# EAGLE schematic SaLAltimeter (EAGLE 7.5.0)
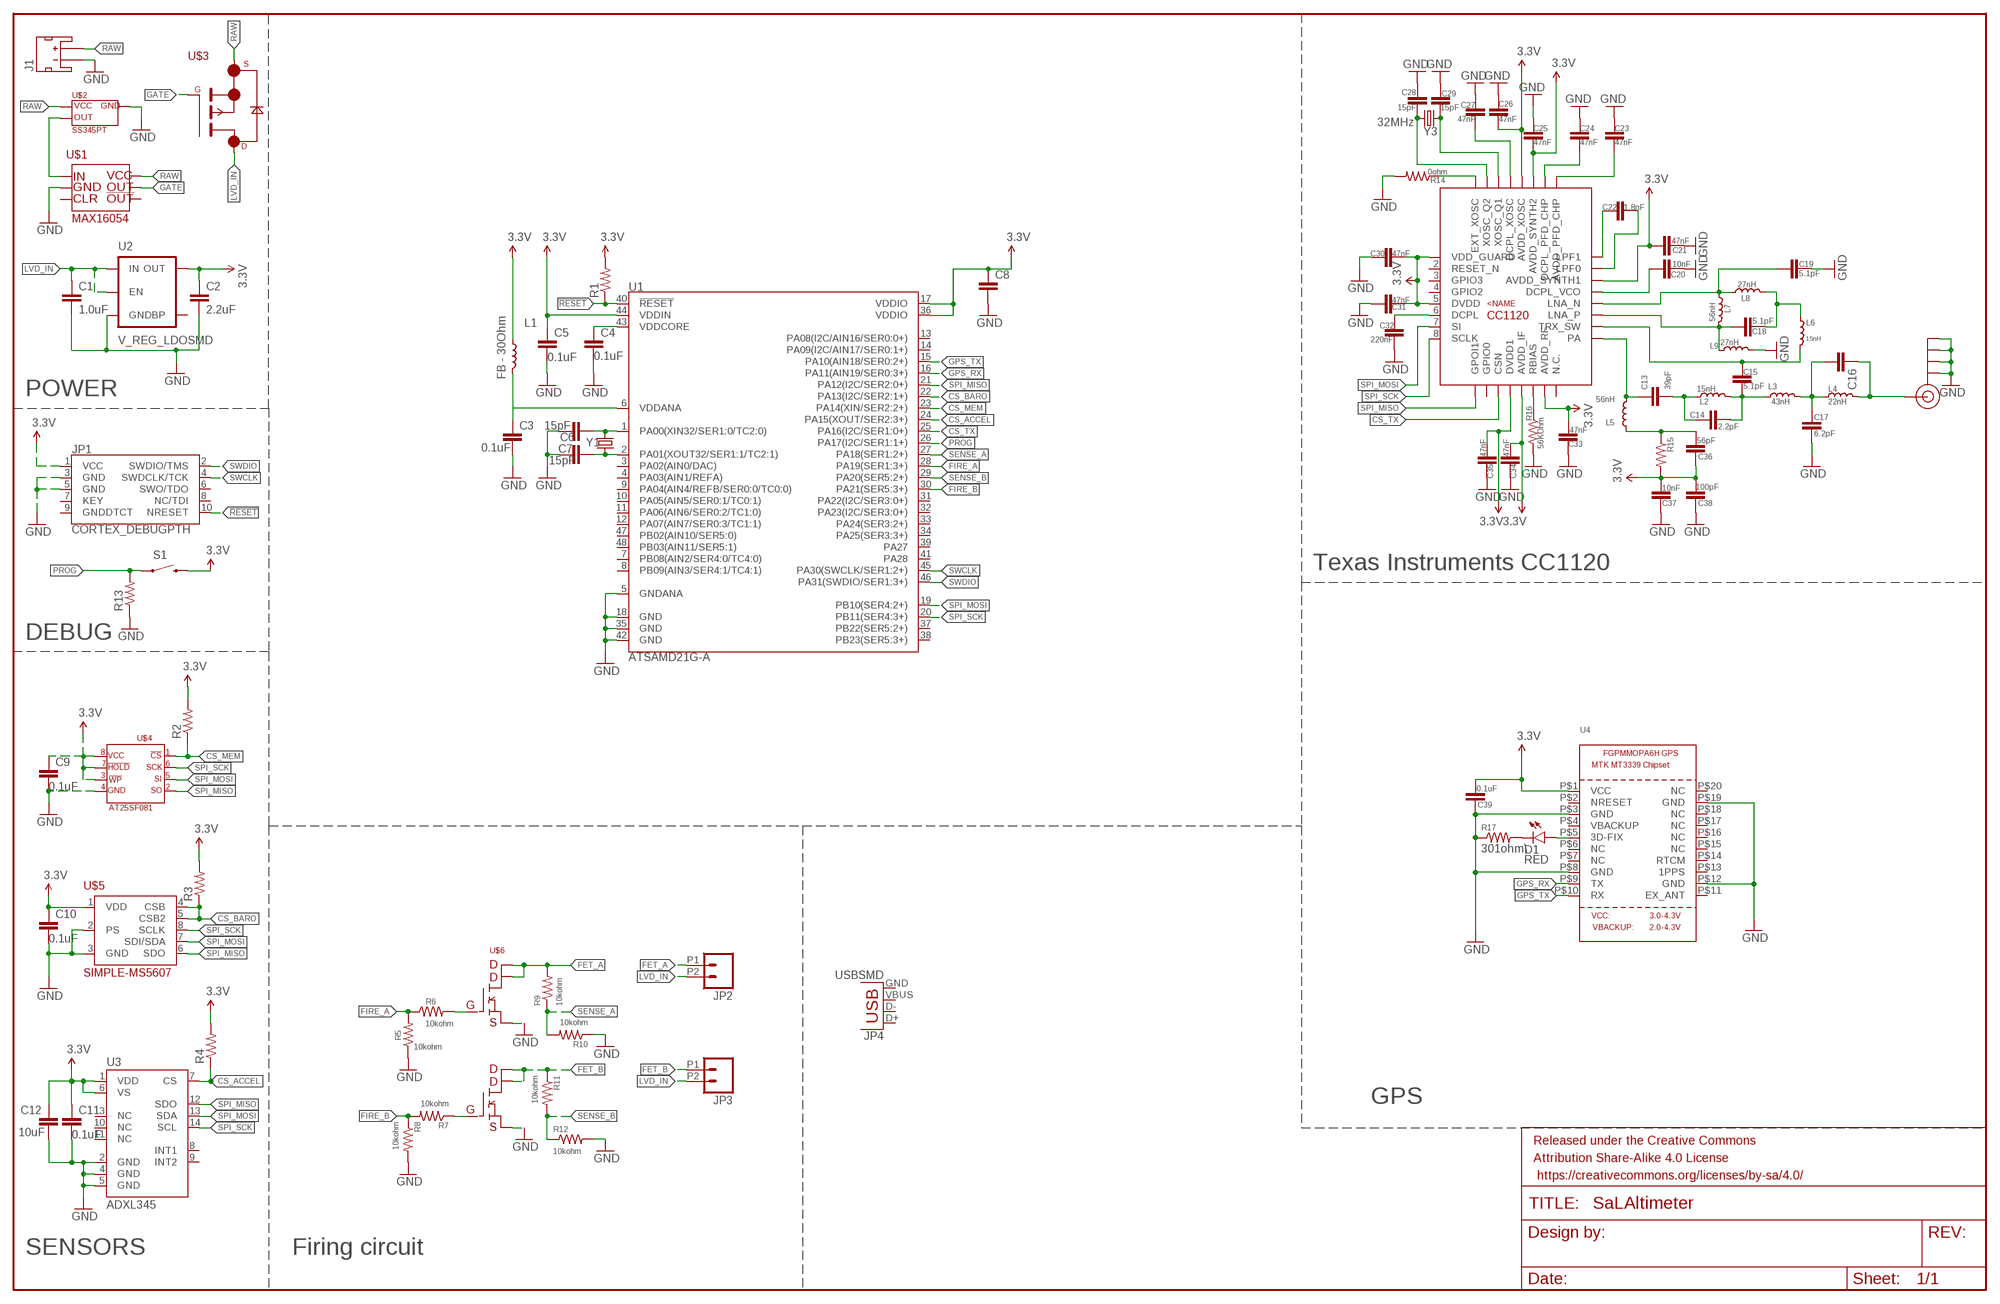
[diagram p0: schematic, sheet 1]

## Parts
C1  1.0uF  CAP0603-CAP  [0603-CAP]
C2  2.2uF  CAP0603-CAP  [0603-CAP]
C3  0.1uF  CAP0402-CAP  [0402-CAP]
C4  0.1uF  CAP0402-CAP  [0402-CAP]
C5  0.1uF  CAP0402-CAP  [0402-CAP]
C6  15pF  CAP0402-CAP  [0402-CAP]
C7  15pF  CAP0402-CAP  [0402-CAP]
C8  CAP0402-CAP  [0402-CAP]
C9  0.1uF  CAP0402-CAP  [0402-CAP]
C10  0.1uF  CAP0402-CAP  [0402-CAP]
C11  0.1uF  CAP0402-CAP  [0402-CAP]
C12  10uF  CAP0402-CAP  [0402-CAP]
C13  39pF  CAP0402-CAP  [0402-CAP]
C14  2.2pF  CAP0402-CAP  [0402-CAP]
C15  5.1pF  CAP0402-CAP  [0402-CAP]
C16  CAP0402-CAP  [0402-CAP]
C17  6.2pF  CAP0402-CAP  [0402-CAP]
C18  5.1pF  CAP0402-CAP  [0402-CAP]
C19  5.1pF  CAP0402-CAP  [0402-CAP]
C20  10nF  CAP0402-CAP  [0402-CAP]
C21  47nF  CAP0402-CAP  [0402-CAP]
C22  1.8nF  CAP0402-CAP  [0402-CAP]
C23  47nF  CAP0402-CAP  [0402-CAP]
C24  47nF  CAP0402-CAP  [0402-CAP]
C25  47nF  CAP0402-CAP  [0402-CAP]
C26  47nF  CAP0402-CAP  [0402-CAP]
C27  47nF  CAP0402-CAP  [0402-CAP]
C28  15pF  CAP0402-CAP  [0402-CAP]
C29  15pF  CAP0402-CAP  [0402-CAP]
C30  47nF  CAP0402-CAP  [0402-CAP]
C31  47nF  CAP0402-CAP  [0402-CAP]
C32  220nF  CAP0402-CAP  [0402-CAP]
C33  47nF  CAP0402-CAP  [0402-CAP]
C34  47nF  CAP0402-CAP  [0402-CAP]
C35  47nF  CAP0402-CAP  [0402-CAP]
C36  56pF  CAP0402-CAP  [0402-CAP]
C37  10nF  CAP0402-CAP  [0402-CAP]
C38  100pF  CAP0402-CAP  [0402-CAP]
C39  0.1uF  CAP0402-CAP  [0402-CAP]
D1  RED  LED-RED0603  [LED-0603]
FRAME1  FRAME-LEDGER  [CREATIVE_COMMONS]
J1  JST_2MM_MALE  [JST-2-SMD]
J$1  SMA_EDGE  [SMA-EDGE]
JP1  CORTEX_DEBUGPTH  [2X5-PTH-1.27MM]
JP2  M022.54MM_SCREWTERM  [1X02_2.54_SCREWTERM]
JP3  M022.54MM_SCREWTERM  [1X02_2.54_SCREWTERM]
JP4  USBSMD  [USB-MINIB]
L1  FB - 30Ohm  INDUCTOR0603  [0603]
L2  15nH  INDUCTOR0402  [C0402]
L3  43nH  INDUCTOR0402  [C0402]
L4  22nH  INDUCTOR0402  [C0402]
L5  56nH  INDUCTOR0402  [C0402]
L6  15nH  INDUCTOR0402  [C0402]
L7  56nH  INDUCTOR0402  [C0402]
L8  27nH  INDUCTOR0402  [C0402]
L9  27nH  INDUCTOR0402  [C0402]
R1  RESISTOR0402-RES  [0402-RES]
R2  RESISTOR0402-RES  [0402-RES]
R3  RESISTOR0402-RES  [0402-RES]
R4  RESISTOR0402-RES  [0402-RES]
R5  10kohm  RESISTOR0402  [0402-RES]
R6  10kohm  RESISTOR0402  [0402-RES]
R7  10kohm  RESISTOR0402  [0402-RES]
R8  10kohm  RESISTOR0402  [0402-RES]
R9  10kohm  RESISTOR0402  [0402-RES]
R10  10kohm  RESISTOR0402  [0402-RES]
R11  10kohm  RESISTOR0402  [0402-RES]
R12  10kohm  RESISTOR0402  [0402-RES]
R13  RESISTOR0402-RES  [0402-RES]
R14  0ohm  RESISTOR0402-RES  [0402-RES]
R15  RESISTOR0402-RES  [0402-RES]
R16  56KOhm  RESISTOR0402-RES  [0402-RES]
R17  301ohm\  RESISTOR0402-RES  [0402-RES]
S1  SWITCH-MOMENTARY-2SMD-3  [TACTILE_SWITCH_SMD-3]
U1  ATSAMD21G-A  [TQFP-48]
U2  V_REG_LDOSMD  [SOT23-5]
U3  ADXL345  [LGA14]
U4  GPS_FGPMMOPA6H  [FGPMMOPA6H]
U$1  MAX16054  [MAX16054]
U$2  SS345PT  [SS345PT]
U$3  SI7615ADN  [SI7615ADN]
U$4  AT25SF081  [AT25SF081]
U$5  SIMPLE-MS5607  [MS5607]
U$6  SI7232DN  [SI7232DN]
U$7  CC1120  [CC1120]
Y1  CRYSTAL3.2X1.5MM  [CRYSTAL-SMD-3.2X1.5MM]
Y3  32MHz  CRYSTAL5X3  [CRYSTAL-SMD-5X3]

## Nets
3.3V: C2.1 C5.1 C8.1 C9.1 C10.1 C11.1 C12.1 C21.1 C25.2 C26.2 C30.2 C31.2 C33.2 C34.2 C35.2 C36.1 C37.2 C38.2 C39.2 JP1.1(VCC) L1.1 R1.2 R2.2 R3.2 R4.2 R15.2 S1.4 U1.17(VDDIO) U1.36(VDDIO) U1.44(VDDIN) U2.5(OUT) U3.1(VDD) U3.6(VS) U4.P$1(VCC) U$4.!HOLD U$4.!WP U$4.VCC U$5.1(VDD) U$7.1(VDD_GUARD) U$7.5(DVDD) U$7.12(DVDD1) U$7.13(AVDD_IF) U$7.15(AVDD_RF) U$7.22(AVDD_SYNTH1) U$7.27(AVDD_SYNTH2) U$7.28(AVDD_XOSC)
!RESET: JP1.10(NRESET) R1.1 U1.40(!RESET!)
CS_ACCEL: R4.1 U1.24(PA15(XOUT/SER2:3+)) U3.7(CS)
CS_BARO: R3.1 U1.22(PA13(I2C/SER2:1+)) U$5.4(CSB) U$5.5(CSB2)
CS_MEM: R2.1 U1.23(PA14(XIN/SER2:2+)) U$4.!CS
CS_TX: U1.25(PA16(I2C/SER1:0+)) U$7.11(CSN)
FET_A: JP2.P1 R9.2 U$6.7(PIN7) U$6.8(PIN8)
FET_B: JP3.P1 R11.1 U$6.5(PIN5) U$6.6(PIN6)
FIRE_A: R5.2 R6.1 U1.28(PA19(SER1:3+))
FIRE_B: R7.2 R8.1 U1.30(PA21(SER5:3+))
GATE: U$1.OUT U$3.G
GND: C1.2 C2.2 C3.2 C4.2 C5.2 C6.2 C7.2 C8.2 C9.2 C10.2 C11.2 C12.2 C17.2 C19.2 C20.2 C21.2 C23.1 C24.1 C25.1 C26.1 C27.1 C28.1 C29.1 C30.1 C31.1 C32.1 C33.1 C34.1 C35.1 C37.1 C38.1 C39.1 J1.1(-) J$1.GND@0(GND) J$1.GND@1(GND) J$1.GND@2(GND) J$1.GND@3(GND) JP1.3(GND) JP1.5(GND) L9.2 R5.1 R8.2 R10.1 R12.2 R13.1 R14.2 R16.2 R17.1 U1.5(GNDANA) U1.18(GND) U1.35(GND) U1.42(GND) U2.2(GND) U3.2(GND) U3.4(GND) U3.5(GND) U4.P$3(GND) U4.P$8(GND) U4.P$12(GND) U4.P$19(GND) U$1.GND U$2.GND U$4.GND U$5.2(PS) U$5.3(GND) U$6.1(PIN1) U$6.3(PIN3)
GPS_RX: U1.16(PA11(AIN19/SER0:3+)) U4.P$9(TX)
GPS_TX: U1.15(PA10(AIN18/SER0:2+)) U4.P$10(RX)
LVD_IN: C1.1 JP2.P2 JP3.P2 U2.1(IN) U2.3(EN) U$3.D1(D) U$3.D2(D) U$3.D3(D) U$3.D4(D)
N$1: R6.2 U$6.2(PIN2)
N$2: U$1.IN U$2.OUT
N$3: C6.1 U1.1(PA00(XIN32/SER1:0/TC2:0)) Y1.P$2
N$4: C7.1 U1.2(PA01(XOUT32/SER1:1/TC2:1)) Y1.P$1
N$5: C3.1 L1.2
N$6: C4.1 U1.43(VDDCORE)
N$7: U1.6(VDDANA)
N$8: R7.1 U$6.4(PIN4)
N$9: C13.1 L5.2 U$7.17(PA)
N$10: C13.2 C14.1 L2.1
N$11: C14.2 C15.1 L2.2 L3.1
N$12: C16.2 C17.1 L3.2 L4.1
N$13: C16.1 J$1.SIG(SIGNAL) L4.2
N$15: C23.2 U$7.25(AVDD_PFD_CHP)
N$16: C15.2 L6.2 U$7.18(TRX_SW)
N$17: C18.1 L7.2 L9.1 U$7.19(LNA_P)
N$18: C18.2 L6.1 L8.2
N$19: C19.1 L7.1 L8.1 U$7.20(LNA_N)
N$20: C22.1 U$7.24(LPF1)
N$21: C22.2 U$7.23(LPF0)
N$22: C20.1 U$7.21(DCPL_VCO)
N$23: C24.2 U$7.26(DCPL_PFD_CHP)
N$24: R16.1 U$7.14(RBIAS)
N$25: R14.1 U$7.32(EXT_XOSC)
N$26: C27.2 U$7.29(DCPL_XOSC)
N$27: C29.2 U$7.30(XOSC_Q1) Y3.3
N$28: C28.2 U$7.31(XOSC_Q2) Y3.1
N$30: D1.C R17.2
N$31: D1.A U4.P$5(3D-FIX)
N$34: C32.2 U$7.6(DCPL)
N$38: C36.2 L5.1 R15.1
PROG: R13.2 S1.1 U1.26(PA17(I2C/SER1:1+))
RAW: J1.2(+) U$1.VCC U$2.VCC U$3.S1(S) U$3.S2(S) U$3.S3(S)
SENSE_A: R9.1 R10.2 U1.27(PA18(SER1:2+))
SENSE_B: R11.2 R12.1 U1.29(PA20(SER5:2+))
SPI_MISO: U1.21(PA12(I2C/SER2:0+)) U3.12(SDO) U$4.SO U$5.6(SDO) U$7.9(GPOI1)
SPI_MOSI: U1.19(PB10(SER4:2+)) U3.13(SDA) U$4.SI U$5.7(SDI/SDA) U$7.7(SI)
SPI_SCK: U1.20(PB11(SER4:3+)) U3.14(SCL) U$4.SCK U$5.8(SCLK) U$7.8(SCLK)
SWCLK: JP1.4(SWDCLK/TCK) U1.45(PA30(SWCLK/SER1:2+))
SWDIO: JP1.2(SWDIO/TMS) U1.46(PA31(SWDIO/SER1:3+))
Unconnected: J1.NC1(PAD1) J1.NC2(PAD2) JP1.6(SWO/TDO) JP1.7(KEY) JP1.8(NC/TDI) JP1.9(GNDDTCT) JP4.D+ JP4.D- JP4.GND JP4.VBUS U1.3(PA02(AIN0/DAC)) U1.4(PA03(AIN1/REFA)) U1.7(PB08(AIN2/SER4:0/TC4:0)) U1.8(PB09(AIN3/SER4:1/TC4:1)) U1.9(PA04(AIN4/REFB/SER0:0/TC0:0)) U1.10(PA05(AIN5/SER0:1/TC0:1)) U1.11(PA06(AIN6/SER0:2/TC1:0)) U1.12(PA07(AIN7/SER0:3/TC1:1)) U1.13(PA08(I2C/AIN16/SER0:0+)) U1.14(PA09(I2C/AIN17/SER0:1+)) U1.31(PA22(I2C/SER3:0+)) U1.32(PA23(I2C/SER3:0+)) U1.33(PA24(SER3:2+)) U1.34(PA25(SER3:3+)) U1.37(PB22(SER5:2+)) U1.38(PB23(SER5:3+)) U1.39(PA27) U1.41(PA28) U1.47(PB02(AIN10/SER5:0)) U1.48(PB03(AIN11/SER5:1)) U2.4(BP) U3.3(NC) U3.8(INT1) U3.9(INT2) U3.10(NC) U3.11(NC) U4.P$2(NRESET) U4.P$4(VBACKUP) U4.P$6(NC) U4.P$7(NC) U4.P$11(EX_ANT) U4.P$13(1PPS) U4.P$14(RTCM) U4.P$15(NC) U4.P$16(NC) U4.P$17(NC) U4.P$18(NC) U4.P$20(NC) U$1.!OUT U$1.CLR U$7.2(RESET_N) U$7.3(GPIO3) U$7.4(GPIO2) U$7.10(GPIO0) U$7.16(N.C.)

## Notes on the sheet
- POWER
- Texas Instruments CC1120
- DEBUG
- GPS
- SENSORS | Firing circuit

## Library data of the parts
C1 C2 C13-C39 = SparkFun-Capacitors:CAP: Capacitor Standard 0603 ceramic capacitor, and 0.1" leaded capacitor.
C3-C12 = SparkFun-Passives:CAP: Capacitor Standard 0603 ceramic capacitor, and 0.1" leaded capacitor.
D1 = SparkFun-LED:LED-RED: Assorted Red LEDs LilyPad 1206- DIO-09912 1206- DIO-00809 0603- DIO-00819 "SMART" means more efficient and expensive; PROD_ID: DIO-00819
FRAME1 = SparkFun-Aesthetics:FRAME-LEDGER: Schematic Frame Standard 11x14 US Ledger frame
J1 = SparkFun-Connectors:JST_2MM_MALE: Mates to single-cell LiPo batteries. CONN-11443 Now with smashable polarity marks!; BTM_NEG: -; BTM_POS: +; PROD_ID: CONN-11443; TOP_NEG: -; TOP_POS: +
J$1 = SparkFun-Connectors:SMA_EDGE: SMA Antenna Connector End launch SMA connector. The paste layer has been removed so that the connector can be hand soldered onto the board after reflow.
JP1 = SparkFun-Connectors:CORTEX_DEBUG: Cortex Debug Connector Datasheet <http://infocenter.arm.com/help/topic/com.arm.doc.faqs/attached/13634/cortex_debug_connectors.pdf>
JP2 JP3 = SparkFun-Connectors:M02: Standard 2-pin 0.1" header. Use with - straight break away headers ( PRT-00116) - right angle break away headers (PRT-00553) - swiss pins (PRT-00743) - machine pins (PRT-00117) - female headers (PRT-00115) Molex polarized connector foot print use with: PRT-08233 with associated crimp pins and housings. 2.54_SCREWTERM for use with PRT-10571. 3.5mm Screw Terminal footprints for PRT-08084 5mm Screw Terminal footprints for use with PRT-08432
JP4 = SparkFun-Connectors:USB: USB Connectors USB-B-PTH is fully proven SKU : PRT-00139/CONN-08278 USB-miniB is fully proven SKU : PRT-00587 USB-A-PCB is untested. USB-A-H is throughly reviewed, but untested. Spark Fun Electronics SKU : PRT-00437 USB-B-SMT is throughly reviewed, but untested. Needs silkscreen touching up. USB-A-S has not been used/tested USB-MB-H has not been used/tested USB-MICROB has been used. CONN-09505; PROD_ID: CONN-08193
L1-L9 = SparkFun-Passives:INDUCTOR: Inductors Basic Inductor/Choke - 0603 and 1206. Footprints are not proven and vary greatly between part numbers. INDUCTOR POWER 3.3UH 4.0A SMD 0.197" L x 0.197" W x 0.177" H (5.00mm x 5.00mm x 4.50mm)
R1-R4 R13-R17 = SparkFun-Passives:RESISTOR: Resistor Basic schematic elements and footprints for 0603, 1206, and PTH resistors.
R5-R12 = SparkFun-Resistors:RESISTOR: Resistor Basic schematic elements and footprints for 0603, 1206, and PTH resistors.
S1 = SparkFun-Electromechanical:SWITCH-MOMENTARY-2: Various NO switches- pushbuttons, reed, etc
U1 = SparkFun-DigitalIC:ATSAMD21G: Atmel SAMD21G SMART ARM-Based Microcontroller The Atmel ® | SMART ™ SAM D21 is a series of low-power microcontrollers using the 32-bit ARM ® Cortex ® -M0+ processor, and ranging from 32- to 64-pins with up to 256KB Flash and 32KB of SRAM. The SAM D21 devices operate at a maximum frequency of 48MHz and reach 2.46 CoreMark/MHz. They are designed for simple and intuitive migration with identical peripheral modules, hex compatible code, identical linear address map and pin compatible migration paths between all devices in the product series. All devices include intelligent and flexible peripherals, Atmel Event System for inter-peripheral signaling, and support for capacitive touch button, slider and wheel user interfaces.; PROD_ID: IC-13064
U2 = SparkFun-PowerIC:V_REG_LDO: Voltage Regulator LDO Standard 150mA LDO voltage regulator in SOT-23 layout. Micrel part MIC5205. BP (by-pass) pin is used to lower output noise with 470pF cap.
U3 = SparkFun-Sensors:ADXL345: 3-axis SPI/I2C 2/4/8/16g accelerometer
U4 = adafruit:GPS_FGPMMOPA6H: GPS Module - MTK MT3339 Chipset, -165dBm sensitivity, 22 channels, 10Hz, auto-select external antenna options
U$1 = SaL-lib:MAX16054
U$2 = SaL-lib:SS345PT
U$3 = SaL-lib:SI7615ADN
U$4 = SaL-lib:AT25SF081: AT25SF081 - 8M memory smd
U$5 = MS5607:SIMPLE
U$6 = SaL-lib:SI7232DN: SI7232DN dual
U$7 = SaL-lib:CC1120
Y1 = SparkFun-FreqCtrl:CRYSTAL: Various standard crystals. Proven footprints.
Y3 = SparkFun-FreqCtrl:CRYSTAL: Various standard crystals. Proven footprints.; PROD_ID: XTAL-08218